# Altium schematic sheet POWER.SchDoc
size A3; SheetNumber: 4; SheetTotal: 4; SPICEModelCacheDYLEPMIM: <root> / <DocumentId>DYLEPMIM</DocumentId> / <CacheFrame Number="0"> / <Model Name="jmk107abj106_a-t" Kind="CKT"> / <Text>* JMK107ABJ106_A-T     SPICE MODEL  ( General Type ) / *-------------------------------------------------------------------------------------------------------- / * Model Generated by TAIYO YUDEN Corporation (http://www.ty-top.com) / * Version 1.0 / * TAIYO YUDEN Control No. 170508_161201 / * Copyright(c) 2012 TAIYO YUDEN CO.,LTD. All Rights Reserved. / *-------------------------------------------------------------------------------------------------------- / * / * Products Name : Multilayer Ceramic Capacitors / * / * Characteristics : / *     Capacitance : 10 uF , Rated Voltage : 6.3V , TCC : X5R / *     Case Size : 1.6 x 0.8 / 0.063 x 0.031 [mm/inch] , Thickness : 0.8 / 0.031 [mm/inch] / *     (Conditions: Temperature = 25 degC , DC Bias Current/Voltage = 0A / 0V) / * / * Frequency Range : 40Hz - 3GHz / * / * External Node Assignments : / * / *  1  o---| |---o  2 / * / *-------------------------------------------------------------------------------------------------------- / .SubCkt JMK107ABJ106_A-T 1 2 / **************************** / C0 1 110 8.9623u / Cm 1 101 0.8356u / C1 101 102 0.81545u / Rc1 101 102 407.78 / C2 102 103 0.12008u / Rc2 102 103 130 / C3 103 110 0.025876u / Rc3 103 110 15.28 / C2m 1 301 1.9009u / C21 301 302 2.2016u / Rc21 301 302 2.0077k / C22 302 303 2.8092u / Rc22 302 303 1.4498k / C23 303 304 5.2572u / Rc23 303 304 495.97 / C24 304 305 1.3408u / Rc24 304 305 104.84 / C25 305 306 2.2469u / Rc25 305 306 43.602 / C26 306 307 3.3576u / Rc26 306 307 28.622 / C27 307 308 0.79127u / Rc27 307 308 12.149 / C28 308 309 0.054389u / Rc28 308 309 2.6395 / C29 309 110 958.23p / Rc29 309 110 12.241 / Rp0 1 110 10Meg / L0 110 120 0.23398n / Lm 120 130 0.21547n / L1 120 121 0.13111n / RL1 121 130 0.16354 / L2 120 122 0.18713n / RL2 122 130 0.82225 / L3 120 123 0.35084n / RL3 123 130 0.11873 / CR 120 124 2.098u / LR 124 125 0.50248n / RR 125 130 34.862m / CL 130 140 1.1716p / LL 130 140 0.18847n / RL 130 140 40.014 / Rs 140 2 4.8237m / **************************** / .ends JMK107ABJ106_A-T</Text> / </Model> / </CacheFrame> / </root>
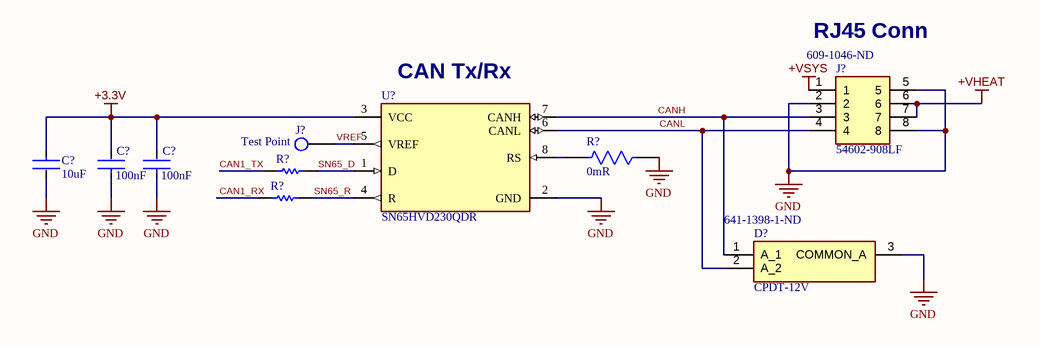
[diagram p0: POWER.SchDoc]

## Parts
(Parts that share a designator on the sheet are numbered #1, #2 ... from top to bottom, then left to right.)
C?#1  Capacitance: 10uF  [FP-0603-L_1_6_0_15-W_0_8-MFG]  (hidden comment: JMK107ABJ106MA-T)
C?#2  Capacitance: 100nF  [FP-GRM155-0_05-MFG]  (hidden comment: GRM155R71C104JA88D)
C?#3  Capacitance: 100nF  [FP-GRM155-0_05-MFG]  (hidden comment: GRM155R71C104JA88D)
D?  CPDT-12V  Supplier Part Number 1: 641-1398-1-ND  [SOT95P280X100-3N]
J?#1  54602-908LF  Supplier Part Number 1: 609-1046-ND  [54602908LF]
J?#2  Test Point  [PC TEST PT 1mm]  (no BOM)
R?#1  RC0402JR-07300RL  [RESC1005X40X25ML05T10]  (value not drawn)
R?#2  Resistance: 0mR  [FP-RC0402-0_4-MFG]  (hidden comment: RC0402JR-070RP)
R?#3  RC0402JR-07300RL  [RESC1005X40X25ML05T10]  (value not drawn)
U?  SN65HVD230QDR  [FP-D0008A-IPC_C]

## Nets
+3.3V: C?#1.1 C?#2.2 C?#3.2 U?.3(VCC)
+VHEAT: J?#1.6 J?#1.7
+VSYS: J?#1.1
GND: C?#1.2 C?#2.1 C?#3.1 D?.3(COMMON_A) J?#1.2 J?#1.5 J?#1.8 R?#2.1 U?.2(GND)
CAN1_RX: R?#3.1
CAN1_TX: R?#1.1
CANH: D?.1(A_1) J?#1.3 U?.7(CANH)
CANL: D?.2(A_2) J?#1.4 U?.6(CANL)
SN65_D: R?#1.2 U?.1(D)
SN65_R: R?#3.2 U?.4(R)
VREF: J?#2.1 U?.5(VREF)
NetR?#2_2: R?#2.2 U?.8(RS)

## Notes on the sheet
- (near J?#1) RJ45 Conn
- (near U?) CAN Tx/Rx
- DWG. NO.
- REV.
- SHT.
- THIS DOCUMENT AND THE DATA DISCLOSED HEREIN OR HEREWITH IS THE PROPERTY OF ALTIUM LIMITED AND MAY BE FREELY DISTRIBUTED IN WHOLE. NO RIGHTS ARE RESERVED OR EXPRESS OR IMPLIED WARANTEE GIVEN.
- REVISION
- DESCRIPTION
- DATE
- APPROVED
- ENG:
- APPROVALS
- PROJECT
- DSN:
- CHK:
- REFERENCE DOCUMENTS
- PROJECT REVISION:
- TITLE
- DOCUMENT REVISION:
- DESIGN ITEM:
- BOM:
- FAB DWG:
- PCB DWG:
- ASSY DWG:
- SCALE:
- SIZE
- B
- CAGE CODE
- FILE NAME
- DWG NO.
- SHEET
- OF
- REV

## Library data of the parts
C?#1 = CMP-14477-000812-2: None; Tolerance: 20%; Voltage: 6.3V; Dielectric: X5R; Height: 0.8mm; Depth: 0.8mm; Max Operating Temperature: 85°C; Packaging: Tape and Reel; Length: 1.6mm; Voltage Rating: 6.3V; Mount: Surface Mount; Case/Package: 0603; Termination: Wraparound; Min Operating Temperature: -55°C; Width: 0.031inch; RoHS Compliant: Yes; Thickness: 0.037inch
C?#2 C?#3 = CMP-2008-04599-2: CAP CER 0.1UF 16V X7R 0402; Tolerance: 5%; Height: 0.5mm; Min Operating Temperature: -55°C; Voltage Rating: 16V; Termination: Standard; Dielectric: X7R; Max Operating Temperature: 125°C; Package Quantity: 10000; Case/Package: 0402; Case Code (Metric): 1005; Depth: 0.5mm; Voltage: 16V; Width: 0.5mm; RoHS Compliant: Yes; Length: 1mm; Case Code (Imperial): 0402; Thickness: 0.022inch; Mount: Surface Mount; REACH SVHC: No SVHC; Weight: 0.000212oz; Voltage Rating (DC): 16V; Series: GRM; Packaging: Cut Tape; Radiation Hardening: No; Lead Free: Lead Free
D? = CPDT-12V: TVS Diode (Bi-directional); Manufacturer_Name: Comchip Technology; Datasheet Link: https://datasheet.datasheetarchive.com/originals/distributors/Datasheets-DGA26/1841117.pdf; Height: 1.15mm; Manufacturer_Part_Number: CPDT-12V; Mouser Part Number: 750-CPDT-12V; Mouser Price/Stock: https://www.mouser.co.uk/ProductDetail/Comchip-Technology/CPDT-12V?qs=tw%252BuQ%2FB6PO0KPAaKlo8Fww%3D%3D; Arrow Part Number: CPDT-12V; Arrow Price/Stock: https://www.arrow.com/en/products/cpdt-12v/comchip-technology?region=nac; Supplier 1: Digi-Key
J?#1 = 54602-908LF: Connector; Manufacturer_Name: Amphenol; Datasheet Link: https://cdn.amphenol-cs.com/media/wysiwyg/files/documentation/datasheet/inputoutput/io_modularjack.pdf; Height: 12.85mm; Manufacturer_Part_Number: 54602-908LF; Mouser Part Number: 649-54602-908LF; Mouser Price/Stock: https://www.mouser.co.uk/ProductDetail/Amphenol-FCI/54602-908LF?qs=UB9wU2EYlYSRVSFArXBUoA%3D%3D; Arrow Part Number: 54602-908LF; Arrow Price/Stock: https://www.arrow.com/en/products/54602-908lf/amphenol-fci?region=nac; Supplier 1: Digi-Key
J?#2 = PC TEST PT 1mm dia: MS27478 - Connectors Receptacle Electrical Solder Mounting Solder Type Hermetic Seal 38999 Series II; Manufacturer: Keystone Electronics; Manufacturer Part Number: 5000; Body Material: PBT,Bronze; Plating: Silver; Number of Contacts: 1; Insulation: Insulated; Outside Diameter: 2.54mm; Inside Diameter: 1.27mm; Hole Diameter: 1.6mm; Supplier 1: Digi-Key; RoHS: Yes; Category: Connectors; Stock 1: 604682; Pricing 1: 1=0.42000, 25=0.34080, 100=0.30150, 250=0.28304, 500=0.25230, 1000=0.19884, 2500=0.18180, 5000=0.17044 (USD); Mount: Through Hole,PCB; Color: Red; Contact Material: Bronze; Contact Plating: Silver,Tin; Material: Nylon,Bronze,Silver; Housing Color: Red; Package Quantity: 100; Series: THM; Packaging: Bulk; Orientation: Straight; Number of Ports: 1; Length: 7.62mm; Height: 0.3inch; RoHS Compliant: Yes; REACH SVHC: No SVHC; Lead Free: Lead Free; Flammability Rating: UL94 V-0; ComponentLink1URL: https://datasheet.ciiva.com/11836/0900766b8009b7c7-11836046.pdf?src-supplier=RSComponents; ComponentLink1Description: https://datasheet.ciiva.com/11836/0900766b8009b7c7-11836046.pdf?src-supplier=RSComponents; ComponentLink2URL: https://datasheet.ciiva.com/2917/5000-5004-2917627.pdf?src-supplier=Digi-Key; ComponentLink2Description: https://datasheet.ciiva.com/2917/5000-5004-2917627.pdf?src-supplier=Digi-Key; ComponentLink3URL: https://datasheet.ciiva.com/16883/70182825-16883965.pdf?src-supplier=Allied+Electronics; ComponentLink3Description: https://datasheet.ciiva.com/16883/70182825-16883965.pdf?src-supplier=Allied+Electronics; Supplier Part Number 1: 36-5000-ND
R?#1 R?#3 = CMP-1011-00061-2: 300 Ohm 0402; Manufacturer: Yageo / Phycomp; Part Number: RC0402JR-07300RL
R?#2 = CMP-03412-037830-1: RES SMD 0 OHM JUMPER 1/16W 0402; Max Power Dissipation: 63mW; Width: 0.02inch; Height: 0.016inch; Length: 0.039inch; Number of Terminations: 2; Max Operating Temperature: 155°C; Case Code (Metric): 1005; Resistor Type: Thick Film; RoHS Compliant: Yes; Packaging: Tape and Reel; Min Operating Temperature: -55°C; Case/Package: 0402; Features: Moisture Resistant; Case Code (Imperial): 0402
U? = CMP-0315-00033-3: IC TRANSCEIVER HALF 1/1 8SOIC; Max Supply Current: 17mA; Number of Receivers: 1; Data Rate: 1Mbps; Simplex/Duplex: Half Duplex; Receiver Hysteresis: 100mV; Min Supply Voltage: 3V; Max Supply Voltage: 3.6V; Operating Supply Voltage: 3.3V; Number of Pins: 8; RoHS Compliant: Yes; Case/Package: D; Number of Drivers: 1; Packaging: Tape and Reel; Weight: 0.002822oz; Max Operating Temperature: 125°C; Package Quantity: 2500; Min Operating Temperature: -40°C; Nominal Supply Current: 17mA; Radiation Hardening: No; Number of Transceivers: 1; Contact Plating: Gold; Lead Free: Lead Free